# Altium schematic sheet FrontEnd-signals.SchDoc
size A4
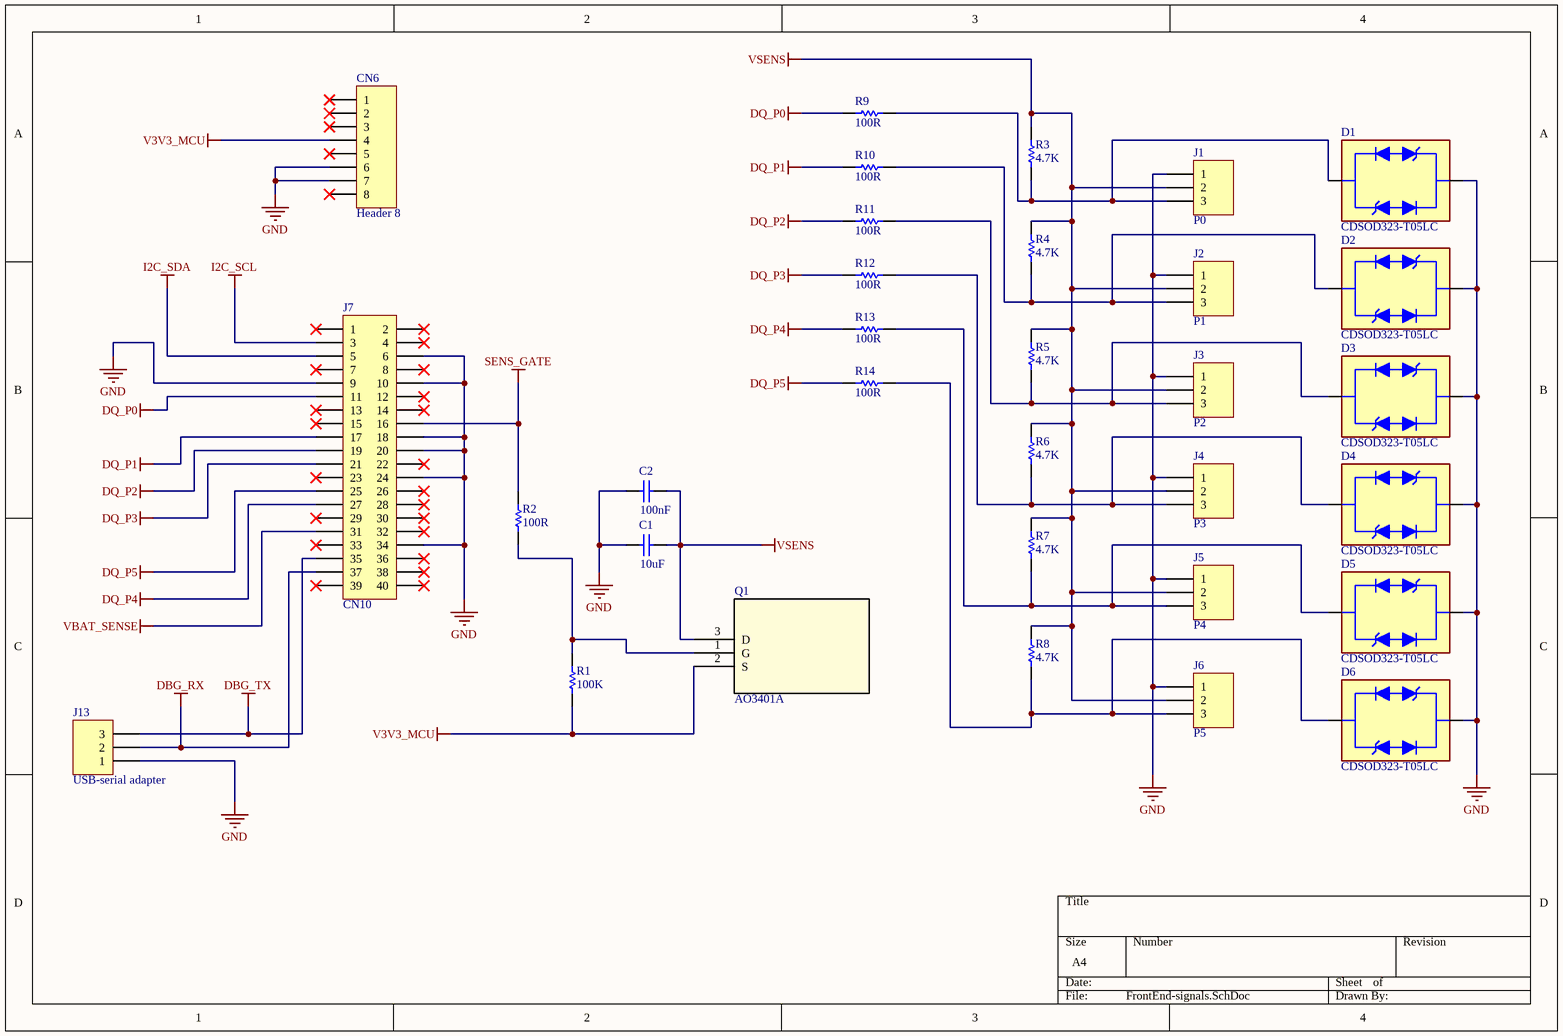
[diagram p0: FrontEnd-signals.SchDoc]

## Parts
C1  value 10uF  [CHIP0805-M]  (hidden comment: Cap)
C2  value 100nF  [CHIP0805-M]  (hidden comment: Cap)
CN6  Header 8  [HDR1X8-P254]
D1  CDSOD323-T05LC  [CDSOD323_BRN-M]
D2  CDSOD323-T05LC  [CDSOD323_BRN-M]
D3  CDSOD323-T05LC  [CDSOD323_BRN-M]
D4  CDSOD323-T05LC  [CDSOD323_BRN-M]
D5  CDSOD323-T05LC  [CDSOD323_BRN-M]
D6  CDSOD323-T05LC  [CDSOD323_BRN-M]
J1  P0  [PHX-MC15-3-G-35]
J2  P1  [PHX-MC15-3-G-35]
J3  P2  [PHX-MC15-3-G-35]
J4  P3  [PHX-MC15-3-G-35]
J5  P4  [PHX-MC15-3-G-35]
J6  P5  [PHX-MC15-3-G-35]
J7  CN10  [HDR2X20-BOX]
J13  USB-serial adapter  [HDR1X3-P254]
Q1  AO3401A  [SOT23-3-M]
R1  value 100K  [CHIP0805-M]  (hidden comment: pullup)
R2  value 100R  [CHIP0805-M]  (hidden comment: pullup)
R3  value 4.7K  [CHIP0805-M]  (hidden comment: pullup)
R4  value 4.7K  [CHIP0805-M]  (hidden comment: pullup)
R5  value 4.7K  [CHIP0805-M]  (hidden comment: pullup)
R6  value 4.7K  [CHIP0805-M]  (hidden comment: pullup)
R7  value 4.7K  [CHIP0805-M]  (hidden comment: pullup)
R8  value 4.7K  [CHIP0805-M]  (hidden comment: pullup)
R9  100R  [CHIP0805-M]
R10  100R  [CHIP0805-M]
R11  100R  [CHIP0805-M]
R12  100R  [CHIP0805-M]
R13  100R  [CHIP0805-M]
R14  100R  [CHIP0805-M]

## Nets
DBG_RX: J7.37 J13.2
DBG_TX: J7.35 J13.3
DQ_P0: J7.11 R9.1
DQ_P1: J7.17 R10.1
DQ_P2: J7.19 R11.1
DQ_P3: J7.21 R12.1
DQ_P4: J7.27 R13.1
DQ_P5: J7.25 R14.1
GND: C1.1 C2.1 CN6.6 CN6.7 D1.2 D2.2 D3.2 D4.2 D5.2 D6.2 J1.1 J2.1 J3.1 J4.1 J5.1 J6.1 J7.6 J7.9 J7.10 J7.18 J7.20 J7.24 J7.34 J13.1
I2C_SCL: J7.3
I2C_SDA: J7.5
SENS_GATE: J7.16 R2.1
V3V3_MCU: CN6.4 Q1.2(S) R1.2
VBAT_SENSE: J7.31
VSENS: C1.2 C2.2 J1.2 J2.2 J3.2 J4.2 J5.2 J6.2 Q1.3(D) R3.1 R4.1 R5.1 R6.1 R7.1 R8.1
NetD1_1: D1.1 J1.3 R3.2 R9.2
NetD2_1: D2.1 J2.3 R4.2 R10.2
NetD3_1: D3.1 J3.3 R5.2 R11.2
NetD4_1: D4.1 J4.3 R6.2 R12.2
NetD5_1: D5.1 J5.3 R7.2 R13.2
NetD6_1: D6.1 J6.3 R8.2 R14.2
NetQ1_1: Q1.1(G) R1.1 R2.2

Not connected (* = marked no-connect by the designer): CN6 1* 2* 3* 5* 8*; J7 1* 2* 4* 7* 8* 12* 13* 14* 15* 22* 23* 26* 28* 29* 30* 32* 33* 36* 38* 39* 40*

## Library data of the parts
C1 C2 = Cap: Capacitor; Published: 8-Jun-2000; LatestRevisionDate: 17-Jul-2002; LatestRevisionNote: Re-released for DXP Platform.; PackageReference: RAD-0.3; Publisher: Altium Limited; PackageDescription: Radial Cap, Thru-Hole; 2 Leads; 0.3 in Pin Spacing
CN6 = Header 8: Header, 8-Pin; LatestRevisionDate: 17-Jul-2002; LatestRevisionNote: Re-released for DXP Platform.; Publisher: Altium Limited
D1-D6 = CDSOD323-T05LC: A 05V, 350W, bi-directional, low capacitance, SOD323 pkg TVS Diode | Bourns CDSOD323-T05LC; SnapEDA_Link: https://www.snapeda.com/parts/CDSOD323-T05LC/Bourns/view-part/?ref=snap; Package: SOD-323 Bourns; Value: *; MF: Bourns; MP: CDSOD323-T05LC; Check_prices: https://www.snapeda.com/parts/CDSOD323-T05LC/Bourns/view-part/?ref=eda
J1-J6 J13 = Header 3: Header, 3-Pin; LatestRevisionDate: 17-Jul-2002; LatestRevisionNote: Re-released for DXP Platform.; Publisher: Altium Limited
J7 = Header 20X2: Header, 20-Pin, Dual row; LatestRevisionDate: 17-Jul-2002; LatestRevisionNote: Re-released for DXP Platform.; Publisher: Altium Limited
Q1 = AO3401A: Description; Manufacturer_Name: Alpha and Omega Semiconductor; Copyright: Copyright (C) 2026 Ultra Librarian. All rights reserved.; Manufacturer_Part_Number: AO3401A; RefDes: RefDes; Type: Type
R1-R14 = Res1: Resistor; Published: 8-Jun-2000; LatestRevisionDate: 17-Jul-2002; LatestRevisionNote: Re-released for DXP Platform.; PackageReference: AXIAL-0.3; Publisher: Altium Limited; PackageDescription: Axial Device, Thru-Hole; 2 Leads; 0.3 in Pin Spacing
  R9-R14: Value: 100R